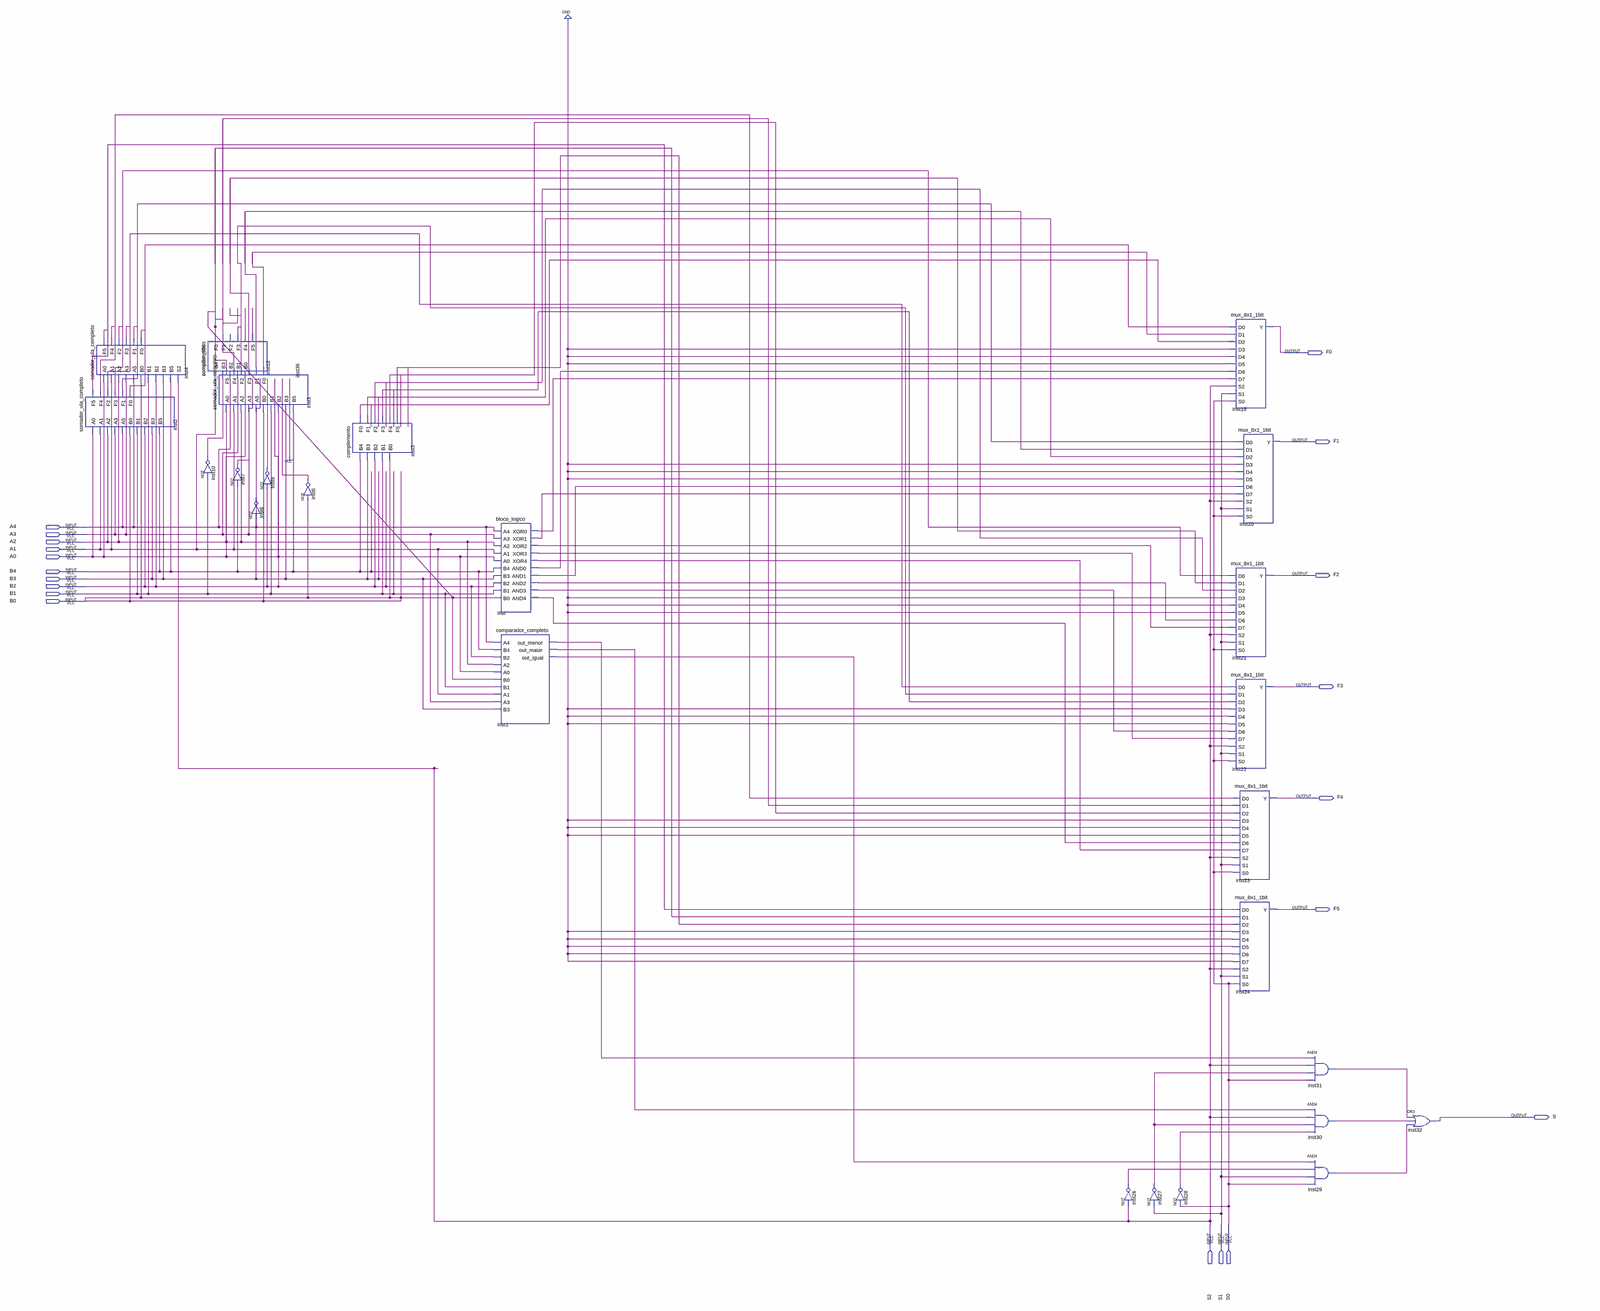
[diagram p0: schematic sheet, whole]
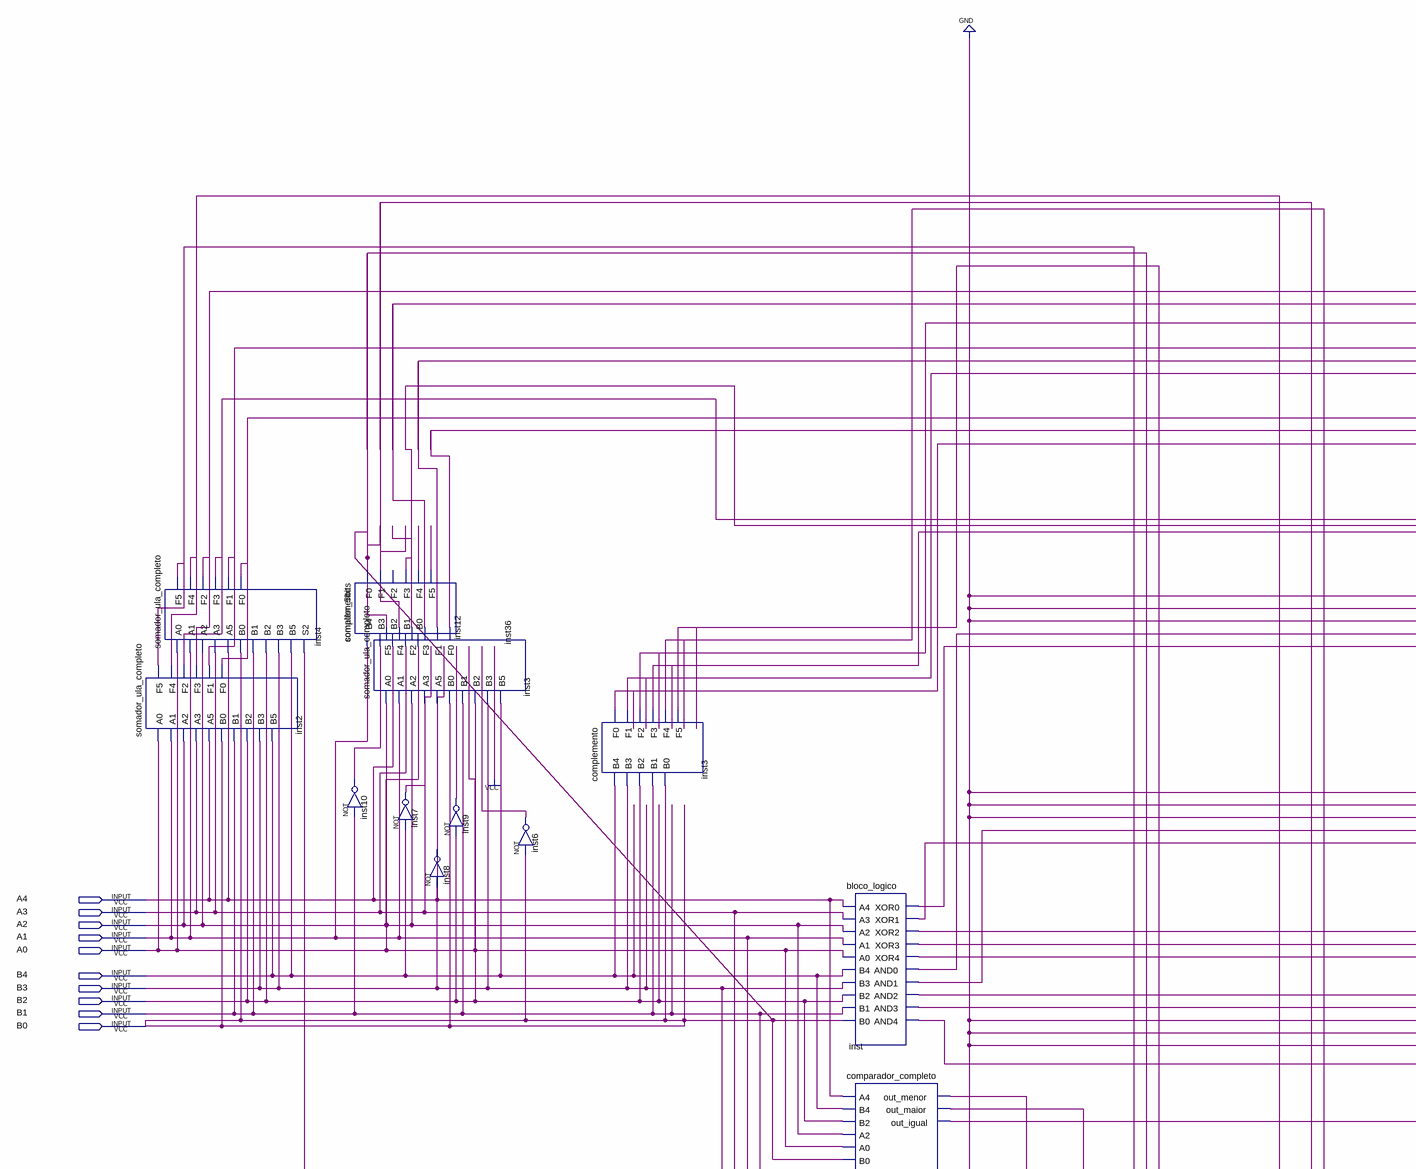
[diagram p1: schematic sheet, upper left part]
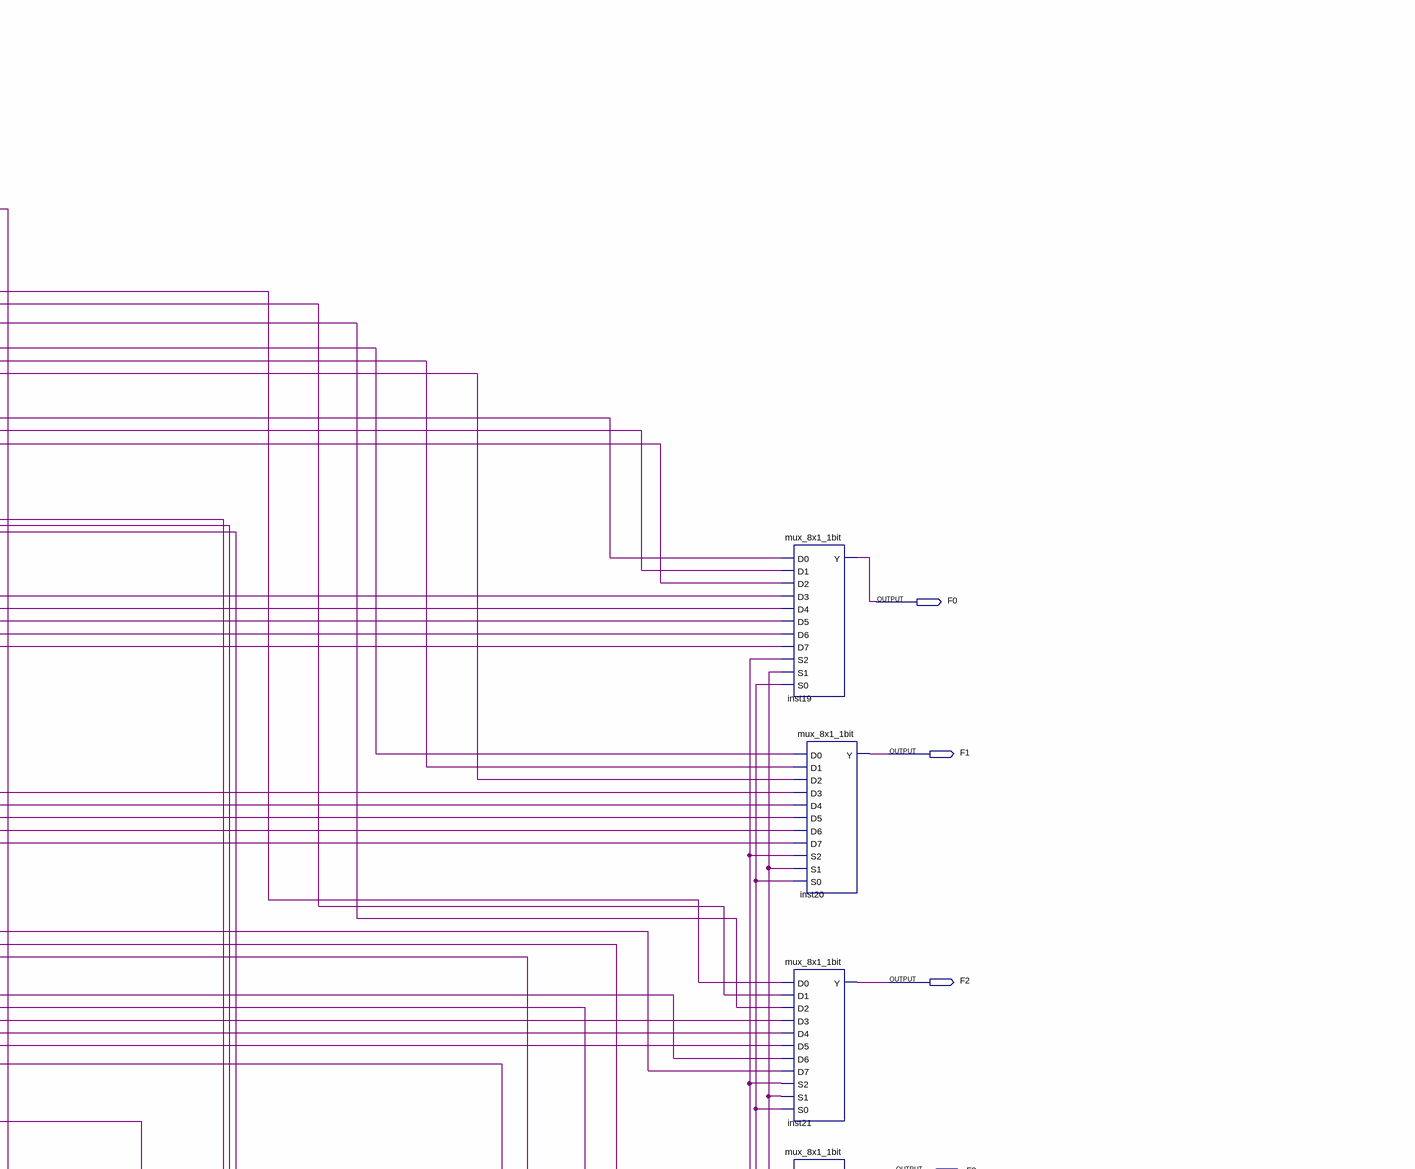
[diagram p2: schematic sheet, upper right part]
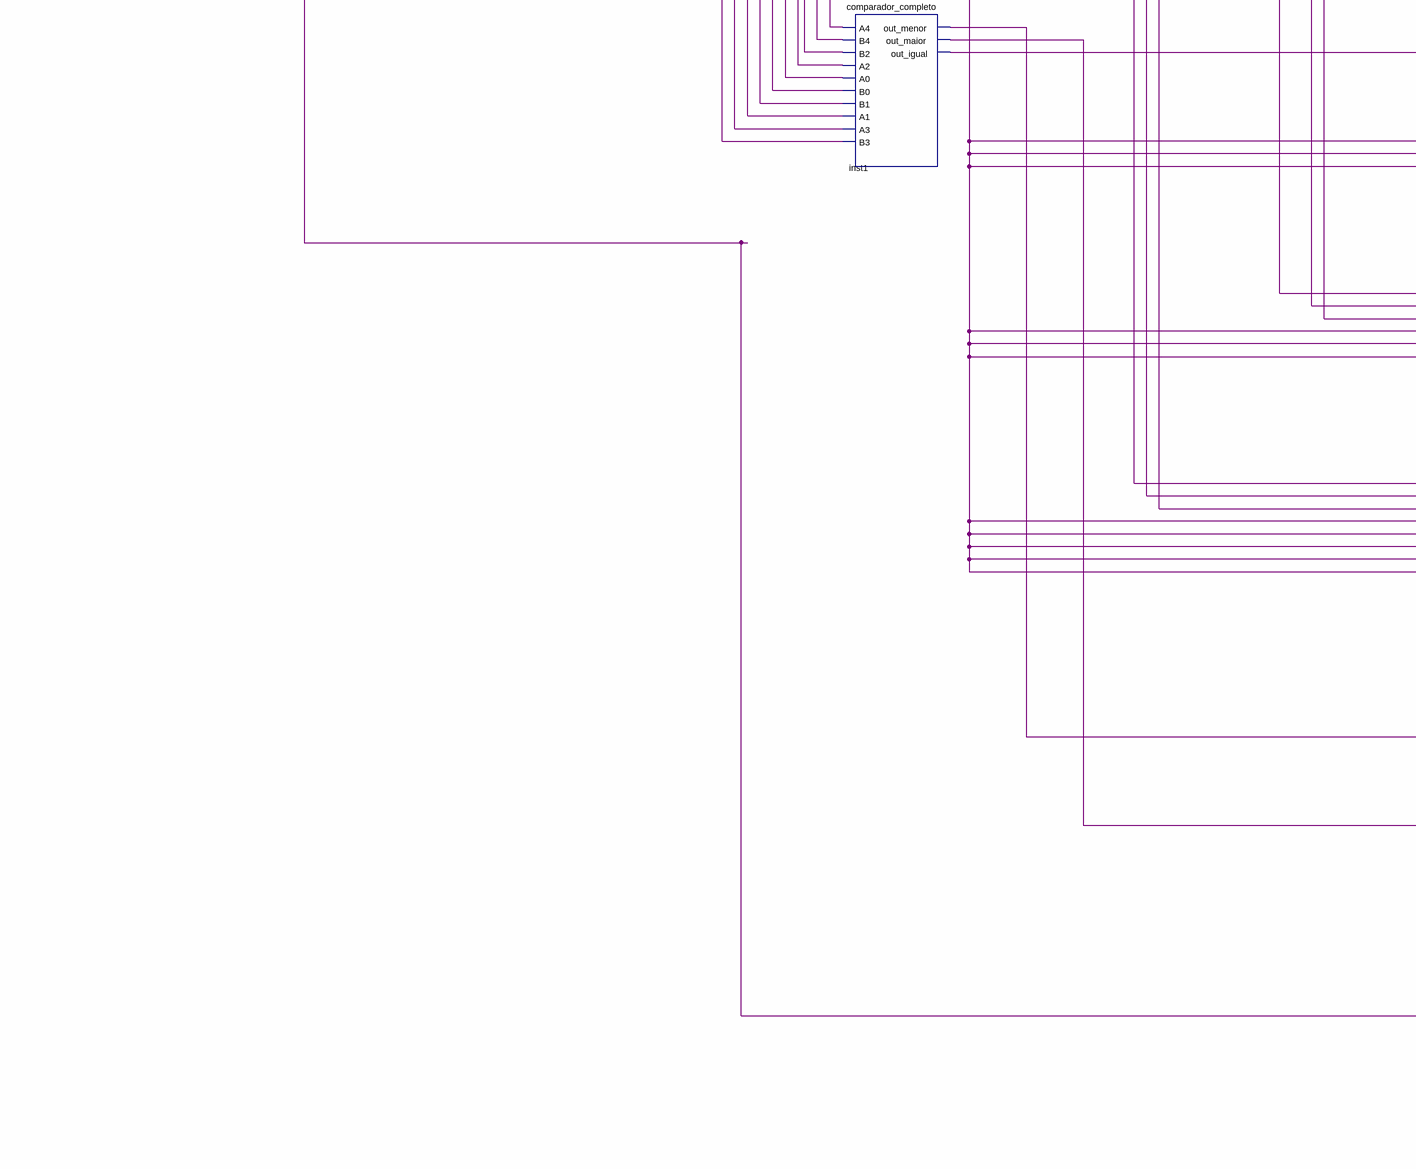
[diagram p3: schematic sheet, lower left part]
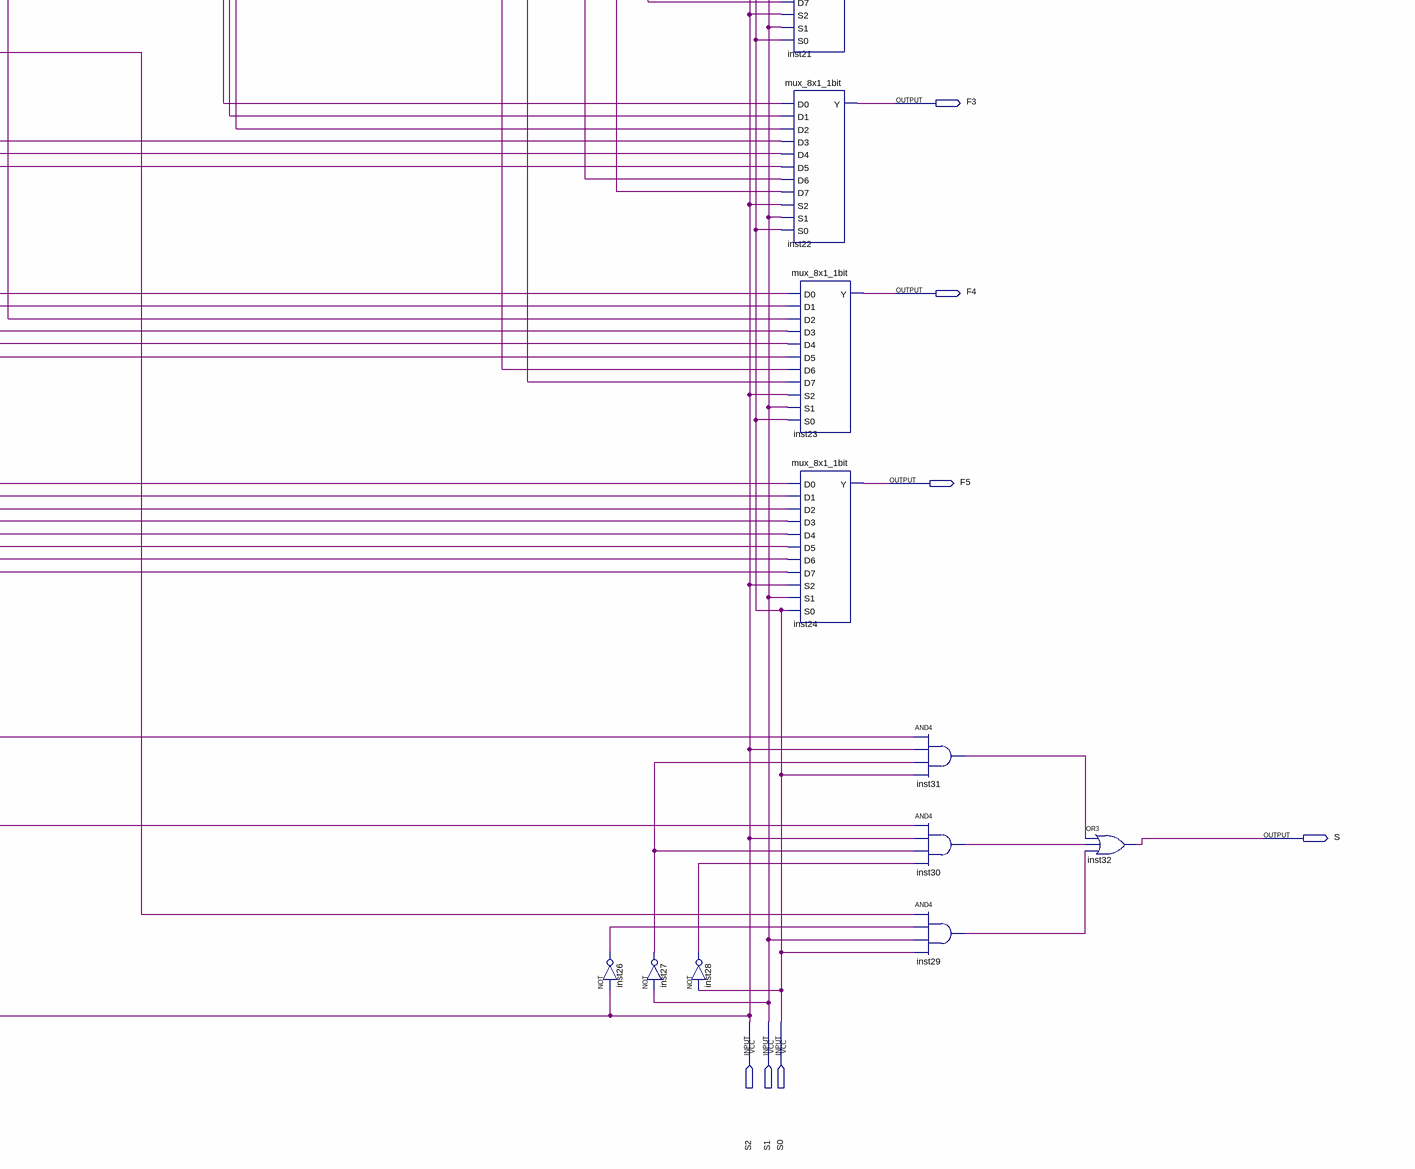
[diagram p4: schematic sheet, lower right part]
// Quartus schematic ULA_Principal.bdf as structural Verilog: 25 symbols, 20 pins
module ULA_Principal (
  input  A4,
  input  A3,
  input  A2,
  input  A1,
  input  A0,
  input  B4,
  input  B3,
  input  B2,
  input  B1,
  input  B0,
  input  S2,
  input  S1,
  input  S0,
  output F0,
  output F1,
  output F2,
  output F3,
  output F4,
  output F5,
  output S
);

  wire inst1_out_igual, inst1_out_maior, inst1_out_menor, inst3_f0, inst3_f0_2, inst3_f1, inst3_f1_2,
       inst3_f2, inst3_f2_2, inst3_f3, inst3_f3_2, inst3_f4, inst3_f4_2, inst3_f5, inst4_f0, inst4_f1,
       inst4_f2, inst4_f3, inst4_f4, inst4_f5, inst6_out, inst7_out, inst8_out, inst9_out, inst10_out,
       inst26_out, inst27_out, inst28_out, inst29_out, inst30_out, inst31_out, inst36_f0, inst36_f1,
       inst36_f3, inst36_f4, inst36_f5, inst_and0, inst_and1, inst_and2, inst_and3, inst_and4, inst_xor0,
       inst_xor1, inst_xor2, inst_xor3, inst_xor4;

  somador_ula_completo inst4 (
    .A0(A0), .A1(A1), .A2(A0), .A3(A3), .A5(A4), .B0(B0), .B1(B1), .B2(A0), .B3(A4), .B5(B4), .S2(S2),
    .F5(inst4_f5), .F4(inst4_f4), .F2(inst4_f2), .F3(inst4_f3), .F1(inst4_f1), .F0(inst4_f0));
  somador_ula_completo inst2 (
    .A0(A0), .A1(A1), .A2(A0), .A3(A3), .A5(A4), .B0(B0), .B1(B1), .B2(A0), .B3(A4), .B5(B4), .F5(inst4_f5),
    .F4(inst4_f4), .F2(inst4_f3), .F3(inst4_f2), .F1(inst4_f1), .F0(inst4_f0));
  somador_5bits inst36 (
    .B4(A1), .B3(inst10_out), .B2(A4), .B1(A3), .B0(A0), .F0(inst36_f0), .F1(inst36_f1), .F3(inst36_f3),
    .F4(inst36_f4), .F5(inst36_f5));  // open: F2
  not inst10 (inst10_out, B1);
  somador_ula_completo inst3 (
    .A0(A0), .A1(A1), .A2(A0), .A3(A3), .A5(A4), .B0(B0), .B1(B1), .B2(A0), .B3(A4), .B5(B4), .F5(inst36_f0),
    .F4(inst3_f4), .F2(inst3_f2), .F3(inst3_f3), .F1(inst3_f1), .F0(inst3_f0));
  not inst7 (inst7_out, B4);
  not inst9 (inst9_out, A0);
  not inst8 (inst8_out, A4);
  not inst6 (inst6_out, B0);
  complemento inst3_dup2 (
    .B4(B4), .B3(A4), .B2(A0), .B1(B1), .B0(B0), .F0(inst3_f0_2), .F1(inst3_f1_2), .F2(inst3_f2_2),
    .F3(inst3_f3_2), .F4(inst3_f4_2), .F5(inst3_f5));
  bloco_logico inst (
    .A4(A4), .A3(A3), .A2(A0), .A1(A1), .A0(A0), .B4(B4), .B3(A4), .B2(A0), .B1(B1), .B0(B0),
    .XOR0(inst_xor0), .XOR1(inst_xor1), .XOR2(inst_xor2), .XOR3(inst_xor3), .XOR4(inst_xor4),
    .AND0(inst_and0), .AND1(inst_and1), .AND2(inst_and2), .AND3(inst_and3), .AND4(inst_and4));
  comparador_completo inst1 (
    .A4(A4), .B4(B4), .B2(A0), .A2(A0), .A0(A0), .B0(B0), .B1(B1), .A1(A1), .A3(A3), .B3(A4),
    .out_menor(inst1_out_menor), .out_maior(inst1_out_maior), .out_igual(inst1_out_igual));
  not inst26 (inst26_out, S2);
  not inst27 (inst27_out, S1);
  not inst28 (inst28_out, S0);
  mux_8x1_1bit inst19 (
    .D0(inst4_f0), .D1(inst3_f0), .D2(inst3_f0_2), .D3(1'b0), .D4(1'b0), .D5(1'b0), .D6(inst_and0),
    .D7(inst_xor0), .S2(S2), .S1(S1), .S0(S0), .Y(F0));
  mux_8x1_1bit inst20 (
    .D0(inst4_f1), .D1(inst3_f1), .D2(inst3_f1_2), .D3(1'b0), .D4(1'b0), .D5(1'b0), .D6(inst_and1),
    .D7(inst_xor1), .S2(S2), .S1(S1), .S0(S0), .Y(F1));
  mux_8x1_1bit inst21 (
    .D0(inst4_f2), .D1(inst3_f3), .D2(inst3_f2_2), .D3(1'b0), .D4(1'b0), .D5(1'b0), .D6(inst_and2),
    .D7(inst_xor2), .S2(S2), .S1(S1), .S0(S0), .Y(F2));
  mux_8x1_1bit inst22 (
    .D0(inst4_f3), .D1(inst3_f2), .D2(inst3_f3_2), .D3(1'b0), .D4(1'b0), .D5(1'b0), .D6(inst_and3),
    .D7(inst_xor3), .S2(S2), .S1(S1), .S0(S0), .Y(F3));
  mux_8x1_1bit inst23 (
    .D0(inst4_f4), .D1(inst3_f4), .D2(inst3_f4_2), .D3(1'b0), .D4(1'b0), .D5(1'b0), .D6(inst_and4),
    .D7(inst_xor4), .S2(S2), .S1(S1), .S0(S0), .Y(F4));
  mux_8x1_1bit inst24 (
    .D0(inst4_f5), .D1(inst36_f0), .D2(inst3_f5), .D3(1'b0), .D4(1'b0), .D5(1'b0), .D6(1'b0), .D7(1'b0),
    .S2(S2), .S1(S1), .S0(S0), .Y(F5));
  and inst31 (inst31_out, inst1_out_menor, S2, inst27_out, S0);
  and inst30 (inst30_out, inst1_out_maior, S2, inst27_out, inst28_out);
  and inst29 (inst29_out, inst1_out_igual, inst26_out, S1, S0);
  or inst32 (S, inst31_out, inst30_out, inst29_out);

  assign A2 = A0;
  assign B2 = A0;
  assign B3 = A4;
endmodule
